# EAGLE design untitled (EAGLE 9.2.2)
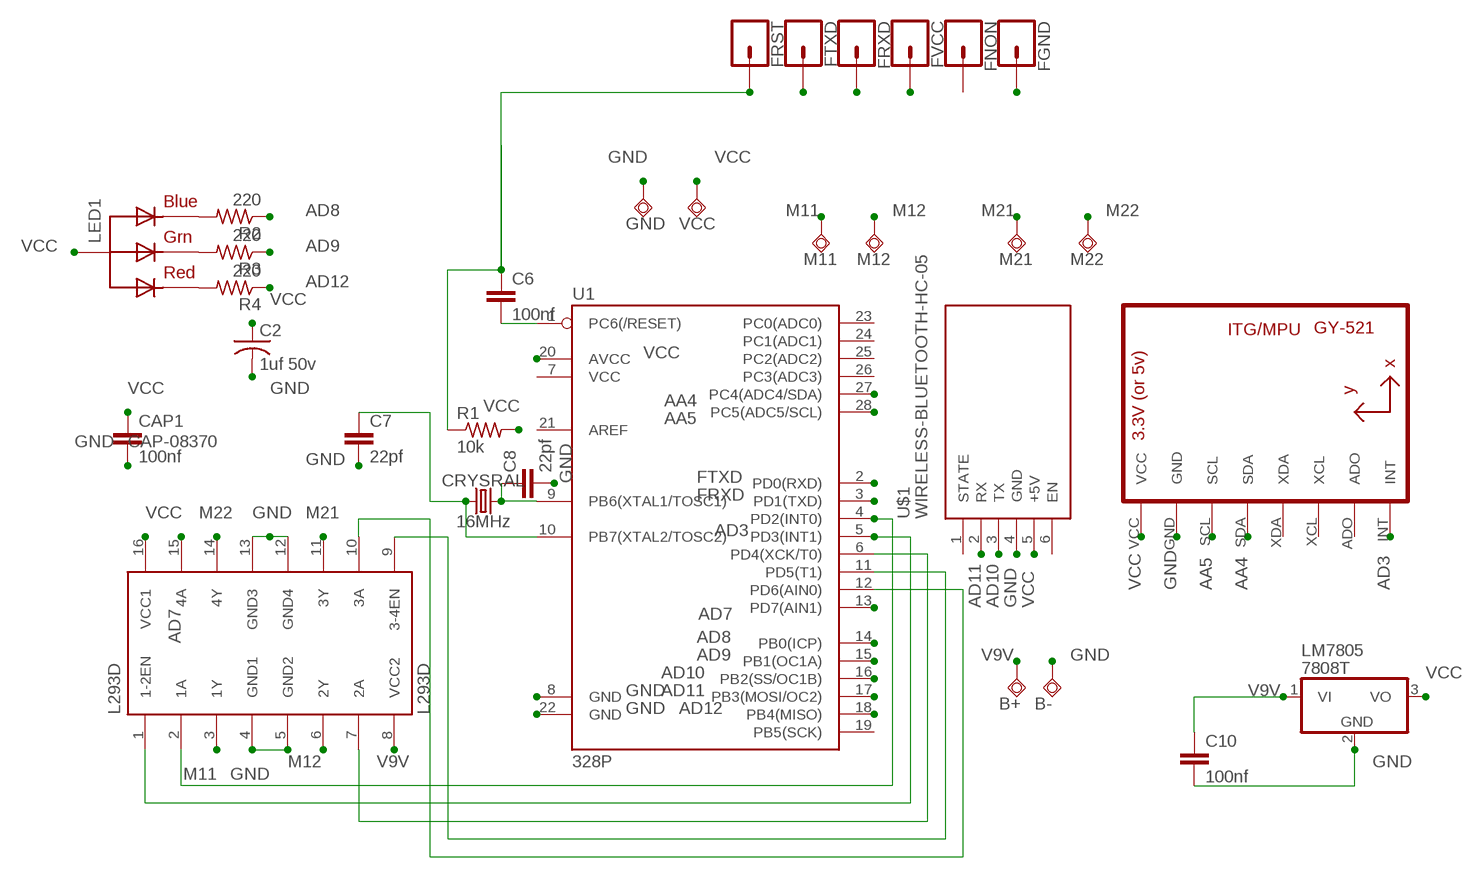
[diagram p0: schematic, sheet 1]

## Parts
B+  TESTPAD_TPSQPAD1-20Y  [TESTPAD_P1-20Y]
B-  TESTPAD_TPSQPAD1-20Y  [TESTPAD_P1-20Y]
C2  1uf 50v  C-US025-024X044  [C025-024X044]
C6  100nf  0.1UF-KIT-EZ-50V-20%  [CAP-PTH-SMALL-KIT]
C7  22pf  0.1UF-KIT-EZ-50V-20%  [CAP-PTH-SMALL-KIT]
C8  22pf  0.1UF-KIT-EZ-50V-20%  [CAP-PTH-SMALL-KIT]
C10  100nf  0.1UF-KIT-EZ-50V-20%  [CAP-PTH-SMALL-KIT]
CAP1  100nf  0.1UF-KIT-EZ-50V-20%  [CAP-PTH-SMALL-KIT]
CRYSRAL  16MHz  CRYSTAL-16MHZPTH-HC49US  [HC49US]
FGND  CONN_01  [1X01]
FNON  CONN_01  [1X01]
FRST  CONN_01  [1X01]
FRXD  CONN_01  [1X01]
FTXD  CONN_01  [1X01]
FVCC  CONN_01  [1X01]
GND  TESTPAD_TPSQB2,54  [TESTPAD_B2,54]
L293D  L293D  [DIL16]
LED1  RGBLED_CA-PIRANHA  [PIRANHA5MM]
LM7805  7808T  [TO220H]
M11  TESTPAD_TPSQPAD1-13  [TESTPAD_P1-13]
M12  TESTPAD_TPSQPAD1-13  [TESTPAD_P1-13]
M21  TESTPAD_TPSQPAD1-13  [TESTPAD_P1-13]
M22  TESTPAD_TPSQPAD1-13  [TESTPAD_P1-13]
R1  10k  R-US_0204/7  [0204/7]
R2  220  R-US_0204/7  [0204/7]
R3  220  R-US_0204/7  [0204/7]
R4  220  R-US_0204/7  [0204/7]
U1  328P  ATMEGA328P_PDIP  [DIP28]
U2  GY-521MPU6050  [GY-521]
U$1  WIRELESS-BLUETOOTH-HC-05  [WIRELESS-BLUETOOTH-HC-05]
VCC  TESTPAD_TPSQB2,54  [TESTPAD_B2,54]

## Nets
AA4: U1.27(PC4(ADC4/SDA)) U2.SDA
AA5: U1.28(PC5(ADC5/SCL)) U2.SCL
AD3: L293D.1(1-2EN) U1.5(PD3(INT1)) U2.INT
AD7: L293D.15(4A) U1.13(PD7(AIN1))
AD8: R2.1 U1.14(PB0(ICP))
AD9: R3.1 U1.15(PB1(OC1A))
AD10: U1.16(PB2(SS/OC1B)) U$1.3(TX)
AD11: U1.17(PB3(MOSI/OC2)) U$1.2(RX)
AD12: R4.1 U1.18(PB4(MISO))
FRXD: FRXD.1 U1.3(PD1(TXD))
FTXD: FTXD.1 U1.2(PD0(RXD))
GND: B-.TP C2.2 C7.2 C8.2 C10.2 CAP1.2 FGND.1 GND.TP L293D.4(GND1) L293D.5(GND2) L293D.12(GND4) L293D.13(GND3) LM7805.2(GND) U1.8(GND) U1.22(GND) U2.GND U$1.4(GND)
M11: L293D.3(1Y) M11.TP
M12: L293D.6(2Y) M12.TP
M21: L293D.11(3Y) M21.TP
M22: L293D.14(4Y) M22.TP
N$1: C6.2 U1.1(PC6(/RESET))
N$2: L293D.2(1A) U1.4(PD2(INT0))
N$3: LED1.1(BLUE) R2.2
N$4: L293D.7(2A) U1.6(PD4(XCK/T0))
N$5: C8.1 CRYSRAL.2 U1.9(PB6(XTAL1/TOSC1))
N$6: C7.1 CRYSRAL.1 U1.10(PB7(XTAL2/TOSC2))
N$7: L293D.9(3-4EN) U1.11(PD5(T1))
N$8: L293D.10(3A) U1.12(PD6(AIN0))
N$9: LED1.2(RED) R4.2
N$10: LED1.3(GREEN) R3.2
N$13: C6.1 FRST.1 R1.1
V9V: B+.TP C10.1 L293D.8(VCC2) LM7805.1(VI)
VCC: C2.1 CAP1.1 FVCC.1 L293D.16(VCC1) LED1.4(VCC) LM7805.3(VO) R1.2 U1.20(AVCC) U2.VCC U$1.5(+5V) VCC.TP
Unconnected: FNON.1 U1.7(VCC) U1.19(PB5(SCK)) U1.21(AREF) U1.23(PC0(ADC0)) U1.24(PC1(ADC1)) U1.25(PC2(ADC2)) U1.26(PC3(ADC3)) U2.ADO U2.XCL U2.XDA U$1.1(STATE) U$1.6(EN)

## Library data of the parts
B+ B- GND M11 M12 M21 M22 VCC = BeagleBone_Blue_R3:TESTPAD_TPSQ: Test pad
C2 = adafruit:C-US: CAPACITOR, American symbol
C6-C8 C10 CAP1 = SparkFun-Capacitors:0.1UF: 0.1µF ceramic capacitors A capacitor is a passive two-terminal electrical component used to store electrical energy temporarily in an electric field.; PROD_ID: CAP-08370; VALUE: 0.1uF
CRYSRAL = SparkFun-Clocks:CRYSTAL-16MHZ: 16MHz Crystal Digikey Example <http://www.digikey.com/product-search/en?keywords=535-9122-1-ND> Frequency: 16MHz Frequency Stability: ±50ppm Frequency Tolerance: ±20ppm Load Capacitance: 18pF SparkFun Products: Pro Micro -5V/16MHz <https://www.sparkfun.com/products/12640> SparkFun Serial Enabled LCD Kit <https://www.sparkfun.com/products/10097>; PROD_ID: XTAL-08181; SF_ID: COM-00536
FGND FNON FRST FRXD FTXD FVCC = SparkFun-Connectors:CONN_01: Single connection point. Often used as Generic Header-pin footprint for 0.1 inch spaced/style header connections On any of the 0.1 inch spaced packages, you can populate with these: Break Away Headers - Straight <https://www.sparkfun.com/products/116> (PRT-00116) Break Away Male Headers - Right Angle <https://www.sparkfun.com/products/553> (PRT-00553) Female Headers <https://www.sparkfun.com/products/115> (PRT-00115) Break Away Headers - Machine Pin <https://www.sparkfun.com/products/117> (PRT-00117) Break Away Female Headers - Swiss Machine Pin <https://www.sparkfun.com/products/743> (PRT-00743) This device is also useful as a general connection point to wire up your design to another part of your project. Our various solder wires solder well into these plated through hole pads. Hook-Up Wire - Assortment (Stranded, 22 AWG) <https://www.sparkfun.com/products/11375> (PRT-11375) Hook-Up Wire - Assortment (Solid Core, 22 AWG) <https://www.sparkfun.com/products/11367> (PRT-11367) View the entire wire category on our website here <https://www.sparkfun.com/categories/141> Special notes: SMTSO-256-ET is a "flush mount" nut for a 4-40 screw. We mostly use this on specialty testbeds; it is a nice way to connect hardware to your PCB at an adjustable hieght. Also note, the SNAP packages are for using a snappable style connector. We sell a baggie of snaps and they are also used on two LilyPad designs: Snap Assortment - 30 pack (male and female) <https://www.sparkfun.com/products/11347> (DEV-11347) LilyPad Arduino SimpleSnap <https://www.sparkfun.com/products/10941> (DEV-10941) LilyPad SimpleSnap Protoboard <https://www.sparkfun.com/products/10940> (DEV-10940)
L293D = st-microelectronics:L293D: PUSH-PULL 4 CHANNEL DRIVER; MPN: L293D; OC_FARNELL: 9589619; OC_NEWARK: 56P8249
LED1 = adafruit:RGBLED_CA: RGB LED, common-anode 5MM Staggered pins 5mm Piranha package http://www.ladyada.net/library/pcb/eaglelibrary.html
LM7805 = linear:78*: Positive VOLTAGE REGULATOR Source: http://cache.national.com/ds/LM/LM78L05.pdf http://www.fairchildsemi.com/ds/LM/LM7805.pdf
R1-R4 = adafruit:R-US_: RESISTOR, American symbol
U1 = SparkFun-IC-Microcontroller:ATMEGA328P_PDIP: Atmel 328P Through hole ATMEGA328P uC used in the Arduino 32kb flash, 1k EEPROM, 2k SRAM Datasheet <http://www.sparkfun.com/datasheets/Components/SMD/ATMega328.pdf> SparkFun Products Storefront component: AVR 28 Pin 20MHz 32K 6A/D - ATMega328P <https://www.sparkfun.com/products/9061> (COM-09061) SparkFun Simon Says - Through-Hole Soldering Kit <https://www.sparkfun.com/products/10547> (KIT-10547) SparkFun Learn to Solder - Simon Says <https://www.sparkfun.com/products/13708> (KIT-13708) SparkFun BigTime Watch Kit <https://www.sparkfun.com/products/11734> (KIT-11734) SparkFun ClockIt <https://www.sparkfun.com/products/10930> (KIT-10930) SparkFun Serial Enabled LCD Kit <https://www.sparkfun.com/products/10097> (LCD-10097) SparkFun Simon Tilts - Through Hole Soldering Kit <https://www.sparkfun.com/products/12634> (KIT-12634) SparkFun Frequency Counter Kit <https://www.sparkfun.com/products/10140> (KIT-10140) FabFM Radio Kit <https://www.sparkfun.com/products/11043> (KIT-11043) SparkFun Binary Blaster Kit <https://www.sparkfun.com/products/12037> (KIT-12037) SparkFun Metro-Gnome <https://www.sparkfun.com/products/9236> (KIT-09236) ATmega328 with Arduino Optiboot (Uno) <https://www.sparkfun.com/products/10524> (DEV-10524); PROD_ID: IC-09136
U2 = gy-521:GY-521
U$1 = diy-modules:WIRELESS-BLUETOOTH-HC-05: Bluetooth Transceiver Module based on HC-05 board Tutorial is available here: https://arduino-info.wikispaces.com/BlueTooth-HC05-HC06-Modules-How-To Click here to find device on ebay.com <http://www.ebay.com/sch/hc-05+module+rs232>

## Net classes
0 default: width 0.762 mm

## Board
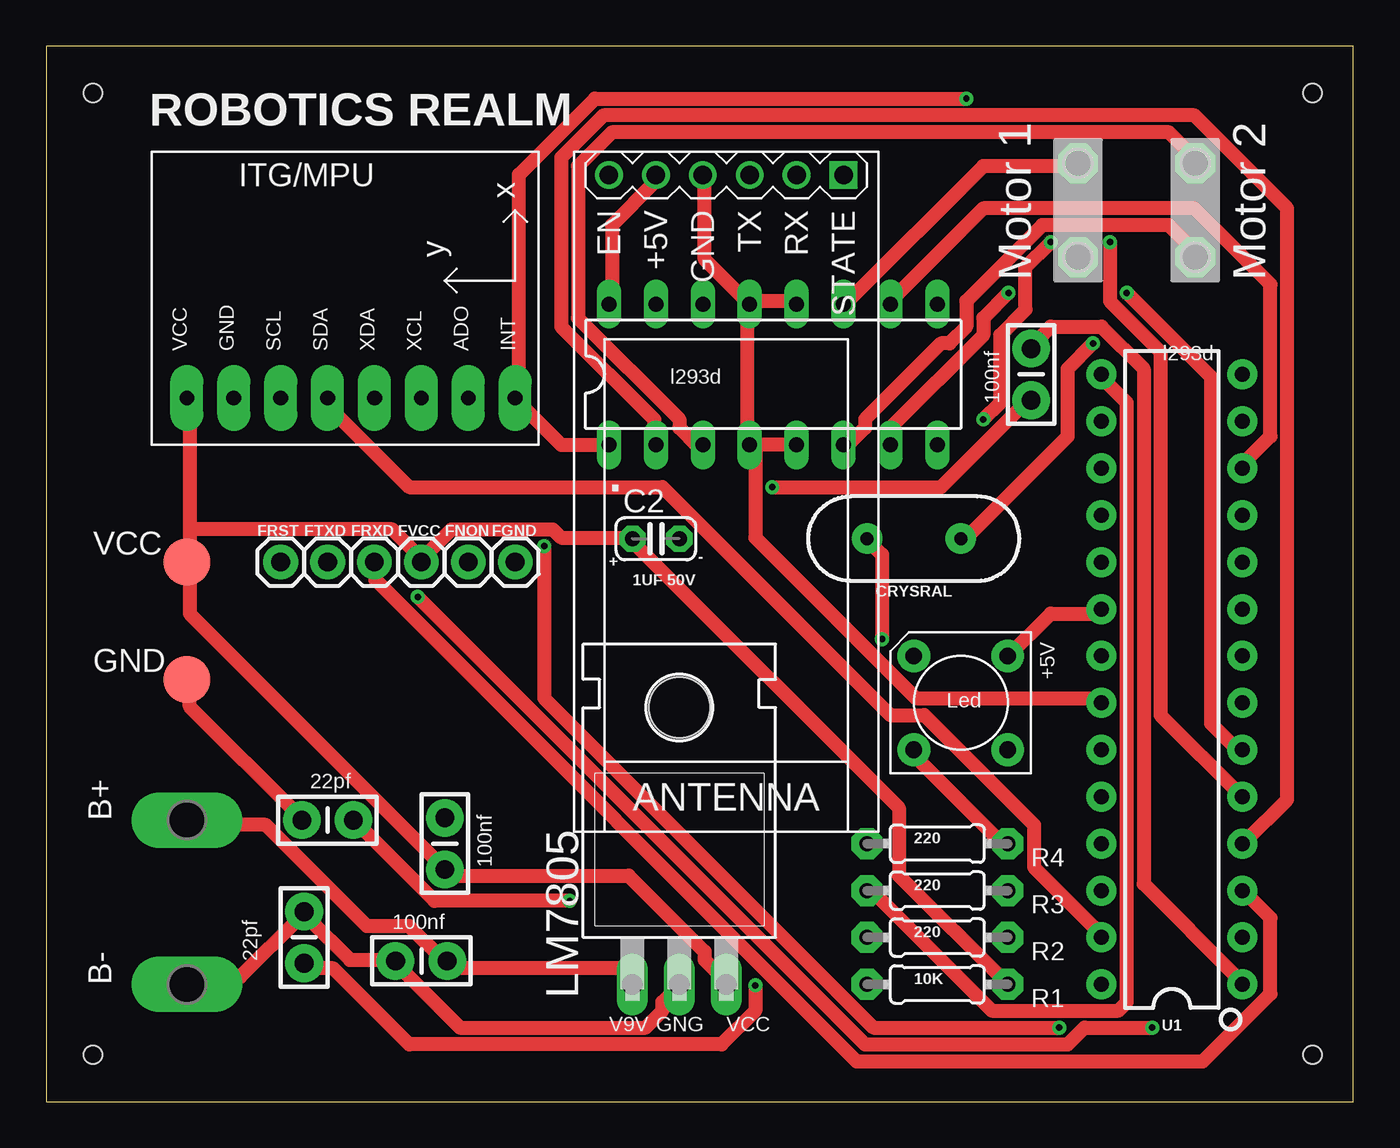
[diagram p1: board, top side]
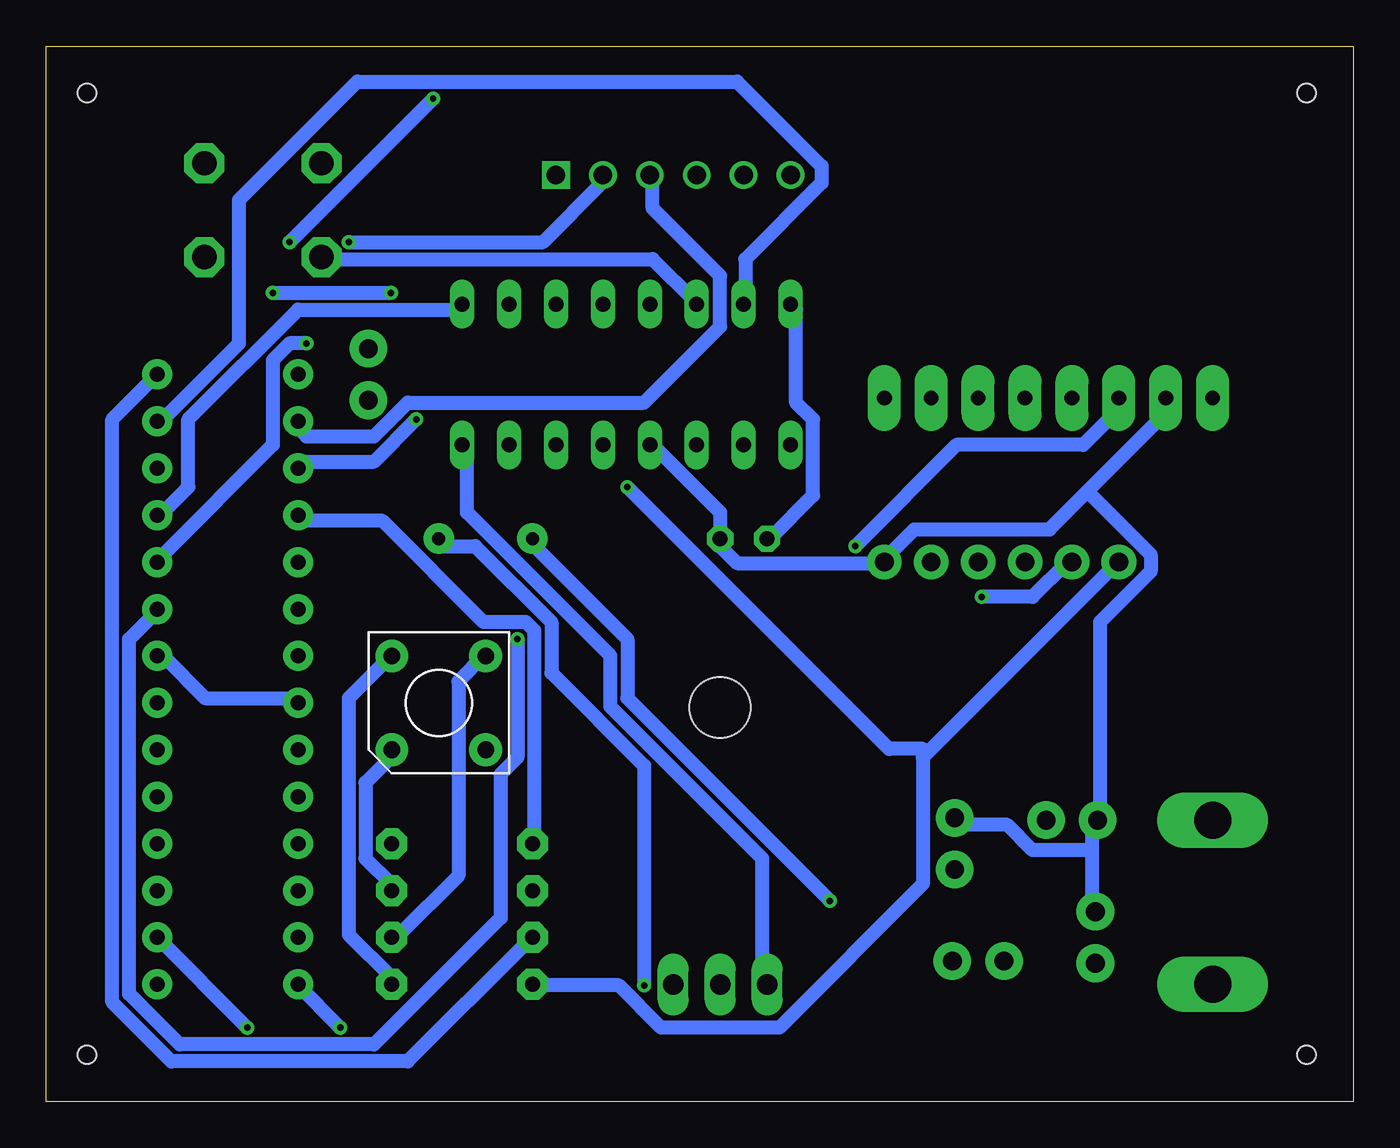
[diagram p2: board, bottom side, seen from below]

Size 70.79 x 57.14 mm. Coordinates in mm from the lower left corner, seen from the top.
Outline: 0,0 70.79,0 70.79,57.14 0,57.14 0,0
Copper layers (1*16): Top 0.035mm / dielectric 1.5mm / Bottom 0.035mm
Design rules "default": minimum track width 6mil, minimum drill 0.35mm, track to track 6mil, track to pad 6mil, pad to pad 6mil, via to via 6mil, smd to smd 6mil, copper to edge 40mil, drill to drill 6mil, minimum pad ring 10mil, minimum via ring 8mil, stop-mask expansion 4mil, vias tented up to drill 0mil, thermal gap 10mil
Holes 1 mm at 2.54,54.61 2.54,2.54 68.58,54.61 68.58,2.54

### Footprints (pad centres in the part's own frame; a part is rotated, then mirrored left to right if it is on the bottom)
TESTPAD_P1-20Y = drill 2.007 pad 2.54 long: TP 0,0
C025-024X044 = drill 0.813 pad 1.422 octagon: 1 -1.27,0; 2 1.27,0
CAP-PTH-SMALL-KIT = drill 1.016 pad 2.032: 1 -1.397,0; 2 1.397,0
HC49US = drill 0.7 pad 1.651: 1 -2.54,0; 2 2.54,0
1X01 = drill 1.016 pad 1.88: 1 0,0
TESTPAD_B2,54 = smd 2.54 x 2.54: TP 0,0
DIL16 = drill 0.813 long: 1 -8.89,-3.81; 2 -6.35,-3.81; 3 -3.81,-3.81; 4 -1.27,-3.81; 5 1.27,-3.81; 6 3.81,-3.81; 7 6.35,-3.81; 8 8.89,-3.81; 9 8.89,3.81; 10 6.35,3.81; 11 3.81,3.81; 12 1.27,3.81; 13 -1.27,3.81; 14 -3.81,3.81; 15 -6.35,3.81; 16 -8.89,3.81
PIRANHA5MM = drill 0.9 pad 1.778: 1 -2.54,2.54; 2 -2.54,-2.54; 3 2.54,-2.54; 4 2.54,2.54
TO220H = drill 1.118 long: 1 -2.54,-10.16; 2 0,-10.16; 3 2.54,-10.16 | hole 3.302: 0,4.826
TESTPAD_P1-13 = drill 1.321 pad 2.159 octagon: TP 0,0
0204/7 = drill 0.813 pad 1.676 octagon: 1 -3.81,0; 2 3.81,0
DIP28 = drill 0.813 pad 1.626: 1 -16.51,-3.81; 2 -13.97,-3.81; 3 -11.43,-3.81; 4 -8.89,-3.81; 5 -6.35,-3.81; 6 -3.81,-3.81; 7 -1.27,-3.81; 8 1.27,-3.81; 9 3.81,-3.81; 10 6.35,-3.81; 11 8.89,-3.81; 12 11.43,-3.81; 13 13.97,-3.81; 14 16.51,-3.81; 15 16.51,3.81; 16 13.97,3.81; 17 11.43,3.81; 18 8.89,3.81; 19 6.35,3.81; 20 3.81,3.81; 21 1.27,3.81; 22 -1.27,3.81; 23 -3.81,3.81; 24 -6.35,3.81; 25 -8.89,3.81; 26 -11.43,3.81; 27 -13.97,3.81; 28 -16.51,3.81
GY-521 = drill 0.8 pad 1.778 long: ADO -8.89,-6.35; GND -8.89,6.35; INT -8.89,-8.89; SCL -8.89,3.81; SDA -8.89,1.27; VCC -8.89,8.89; XCL -8.89,-3.81; XDA -8.89,-1.27
WIRELESS-BLUETOOTH-HC-05 = drill 1 square: 1 -6.35,-17.145 | drill 1: 2 -3.81,-17.145; 3 -1.27,-17.145; 4 1.27,-17.145; 5 3.81,-17.145; 6 6.35,-17.145

### Placement (x,y rotation side)
B+  7.62,15.24 90 top
B-  7.62,6.35 90 top
C2  33.02,30.48 0 top
C6  53.34,39.37 90 top
C7  13.97,8.89 90 top
C8  15.24,15.24 180 top
C10  20.32,7.62 180 top
CAP1  21.59,13.97 90 top
CRYSRAL  46.99,30.48 180 top
FGND  25.4,29.21 0 top
FNON  22.86,29.21 0 top
FRST  12.7,29.21 0 top
FRXD  17.78,29.21 0 top
FTXD  15.24,29.21 0 top
FVCC  20.32,29.21 0 top
GND  7.62,22.86 0 top
L293D  39.37,39.37 0 top
LED1  49.53,21.59 0 top
LM7805  34.29,16.51 0 top
M11  62.23,50.8 0 top
M12  62.23,45.72 0 top
M21  55.88,50.8 0 top
M22  55.88,45.72 0 top
R1  48.26,6.35 0 top
R2  48.26,8.89 0 top
R3  48.26,11.43 0 top
R4  48.26,13.97 0 top
U1  60.96,22.86 90 top
U2  16.51,46.99 90 top
U$1  36.83,33.02 180 top
VCC  7.62,29.21 0 top

### Tracks (layer width: path | path; a pad name or v marks a point on that pad's centre or on a via)
AA4
  Top 0.762: U1.27 57.15,9.04 53.49,12.7 53.49,14.99 47.55,20.93 45.72,20.93 33.38,33.27 19.66,33.27 15.09,37.85 U2.SDA
AA5  (via drill 0.35)
  Top 0.762: v54.86,4.01 44.81,4.01 26.98,21.84 v26.98,30.07
  Bottom 0.762: v54.86,4.01 57.15,6.3 U1.28 | v26.98,30.07 21.49,35.56 14.63,35.56 12.34,37.85 U2.SCL
AD3  (via drill 0.35)
  Top 0.762: L293D.1 27.89,35.56 25.6,37.85 U2.INT 25.6,38.3 25.6,50.19 29.72,54.3 v49.84,54.3 | U1.5 60.35,20.93 60.35,40.59 57.61,43.33 v57.61,46.53
  Bottom 0.762: v49.84,54.3 v57.61,46.53
AD7
  Bottom 0.762: L293D.15 32.92,43.33 32.92,45.62 28.8,49.73 28.8,50.65 33.38,55.22 53.95,55.22 60.35,48.82 60.35,41.05 64.47,36.93 U1.13
AD8
  Bottom 0.762: U1.14 67.21,36.93 67.21,5.38 64.01,2.18 51.21,2.18 44.81,8.59 R2.1
AD9
  Top 0.762: U1.15 57.15,39.22 58.52,37.85 58.52,5.38 58.06,4.93 51.21,4.93 44.81,11.33 R3.1
AD10
  Bottom 0.762: U$1.3 37.95,49.73 37.95,48.36 34.29,44.7 34.29,41.96 38.41,37.85 51.21,37.85 53.03,36.02 56.69,36.02 57.15,36.47 U1.16
AD11  (via drill 0.35)
  Top 0.762: v54.41,46.53 53.03,45.16 53.03,42.88 51.66,41.5 51.66,37.85 v50.75,36.93
  Bottom 0.762: v54.41,46.53 43.89,46.53 40.69,49.73 U$1.2 | v50.75,36.93 53.03,34.65 57.15,34.65 U1.17
AD12
  Bottom 0.762: U1.18 57.15,31.45 52.58,31.45 47.09,25.96 44.81,25.96 44.35,25.5 44.35,14.07 R4.1
FRXD
  Top 0.762: U1.3 64.92,11.33 66.29,9.96 66.29,5.84 62.64,2.18 43.89,2.18 17.83,28.25 17.83,29.16 FRXD.1
FTXD  (via drill 0.35)
  Top 0.762: v59.89,4.01 56.24,4.01 55.32,3.1 44.35,3.1 v20.12,27.33
  Bottom 0.762: v59.89,4.01 U1.2 | v20.12,27.33 17.37,27.33 15.54,29.16 FTXD.1
GND
  Top 0.762: LM7805.2 34.29,6.3 33.38,5.38 33.38,4.93 32.46,4.01 22.4,4.01 19.2,7.21 C10.2 18.75,7.67 16.46,7.67 14.17,9.96 C7.2 13.72,9.96 10.52,6.76 7.77,6.76 B-.TP | GND.TP 7.77,22.76 7.77,21.39 13.72,15.44 C8.2 | L293D.5 38.41,35.56 | L293D.13 38.41,43.33 40.23,43.33 L293D.12 | L293D.13 35.66,45.62 35.66,49.73 U$1.4 | L293D.13 37.95,42.88 37.95,35.56 L293D.4 38.41,35.56 | 38.41,35.56 38.41,30.53 47.09,21.84 57.15,21.84 U1.22
  Bottom 0.762: 14.17,13.61 14.17,14.99 C8.2 13.72,15.44 13.72,25.96 10.97,28.7 10.97,29.62 14.4,33.05 | 14.17,13.61 14.17,10.41 C7.2 | 14.17,13.61 17.37,13.61 18.75,14.99 21.49,14.99 CAP1.2 | 14.4,33.05 16.46,30.99 23.77,30.99 25.15,29.62 FGND.1 25.6,29.16 33.38,29.16 34.29,30.07 C2.2 34.29,31.9 37.95,35.56 L293D.4 | 14.4,33.05 10.52,36.93 10.52,37.85 U2.GND | U1.22 57.15,21.84 62.18,21.84 64.47,24.13 U1.8
M11
  Top 0.762: L293D.3 35.2,35.56 34.29,36.47 34.29,36.93 28.8,42.42 28.8,50.65 30.63,52.48 60.81,52.48 62.18,51.11 M11.TP
M12
  Top 0.762: L293D.6 43.43,35.56 44.35,36.47 44.35,36.93 48.46,41.05 48.92,41.05 49.84,41.96 49.84,43.33 53.95,47.45 60.81,47.45 62.18,46.08 M12.TP
M21
  Top 0.762: L293D.11 43.43,43.33 50.75,50.65 55.78,50.65 M21.TP
M22
  Bottom 0.762: L293D.14 35.66,43.33 37.95,45.62 55.78,45.62 M22.TP
N$1
  Top 0.762: U1.1 64.47,6.76 59.44,11.79 59.44,39.68 57.15,41.96 54.41,41.96 53.49,41.05 C6.2
N$2
  Top 0.762: L293D.2 32.92,35.56 32.92,36.93 27.89,41.96 27.89,51.11 30.18,53.39 62.18,53.39 67.21,48.36 67.21,16.36 64.92,14.07 U1.4
N$3
  Bottom 0.762: R2.2 51.66,9.04 48.46,12.24 48.46,22.76 47.09,24.13 LED1.1
N$4  (via drill 0.35)
  Top 0.762: L293D.7 45.72,36.47 50.75,41.5 50.75,42.42 v52.12,43.79 | v58.52,43.79 63.09,39.22 63.09,20.47 64.47,19.1 U1.6
  Bottom 0.762: v58.52,43.79 v52.12,43.79
N$5  (via drill 0.35)
  Top 0.762: v45.26,25.04 45.26,29.62 44.81,30.07 CRYSRAL.2 | v28.35,10.87 21.03,10.87 16.92,14.99 C8.1
  Bottom 0.762: v45.26,25.04 45.26,18.64 46.18,17.73 46.18,9.96 53.03,3.1 63.55,3.1 66.29,5.84 66.29,25.04 64.92,26.42 U1.9 | v28.35,10.87 39.32,21.84 39.32,25.04 44.35,30.07 CRYSRAL.2
N$6  (via drill 0.35)
  Top 0.762: v56.69,41.05 55.32,39.68 55.32,36.02 49.84,30.53 CRYSRAL.1 | v38.41,6.3 38.41,4.93 36.58,3.1 19.66,3.1 15.54,7.21 14.17,7.21 C7.1
  Bottom 0.762: v56.69,41.05 57.61,41.05 58.52,40.13 58.52,35.56 64.47,29.62 U1.10 | v38.41,6.3 38.41,18.19 43.43,23.22 43.43,25.96 47.55,30.07 49.38,30.07 CRYSRAL.1
N$7
  Bottom 0.762: L293D.9 48.46,42.88 57.15,42.88 63.09,36.93 63.09,33.27 64.47,31.9 U1.11
N$8
  Top 0.762: L293D.10 45.72,43.33 50.75,48.36 62.18,48.36 66.29,44.25 66.29,36.02 64.92,34.65 U1.12
N$9
  Top 0.762: R4.2 51.66,14.07 47.09,18.64 LED1.2
N$10
  Bottom 0.762: R3.2 52.12,11.79 53.49,13.16 53.49,17.27 52.12,18.64 LED1.3
N$13  (via drill 0.35)
  Top 0.762: v39.32,33.27 48.46,33.27 53.03,37.85 C6.1
  Bottom 0.762: 23.09,18.87 12.8,29.16 FRST.1 | 23.09,18.87 23.32,18.64 23.32,11.79 31.09,4.01 37.49,4.01 39.78,6.3 44.35,6.3 R1.1 | v39.32,33.27 25.15,19.1 23.32,19.1 23.09,18.87
V9V
  Top 0.762: LM7805.1 31.55,6.76 31.09,7.21 21.95,7.21 C10.1 21.49,7.67 19.66,9.5 17.37,9.5 11.89,14.99 7.77,14.99 B+.TP
  Bottom 0.762: L293D.8 48.01,35.56 48.01,31.9 40.23,24.13 40.23,21.39 32,13.16 32,6.76 LM7805.1
VCC
  Top 0.762: U1.20 57.15,26.42 54.41,26.42 52.12,24.13 LED1.4 | LM7805.3 36.58,6.76 35.66,7.67 35.66,8.13 31.55,12.24 21.95,12.24 CAP1.1 21.49,12.7 7.77,26.42 7.77,29.16 VCC.TP 7.77,29.62 7.77,30.99 | 7.77,30.99 7.77,37.85 U2.VCC | L293D.16 30.63,43.33 30.63,47.45 32.92,49.73 U$1.5 | 7.77,30.99 18.75,30.99 20.12,29.62 FVCC.1 20.57,29.62 21.95,30.99 27.43,30.99 27.89,30.53 31.55,30.53 C2.1 32,30.07 46.18,15.9 46.18,12.24 R1.2
  Bottom 0.762: R1.2 52.12,6.76 54.41,9.04 54.41,21.84 52.12,24.13 LED1.4 | L293D.16 30.18,42.88 30.18,37.85 29.26,36.93 29.26,32.82 31.55,30.53 C2.1

### Text on the board
tPlace: ROBOTICS REALM | Motor 1 | Motor 2 | VCC | GND | SCL | SDA | XDA | XCL | ADO | INT | 100nf | l293d | l293d | . | + | - | 1UF 50V | +5V | Led | 22pf | 220 | 100nf | 220 | 100nf | 220 | 22pf | 10K | V9V | GNG | VCC